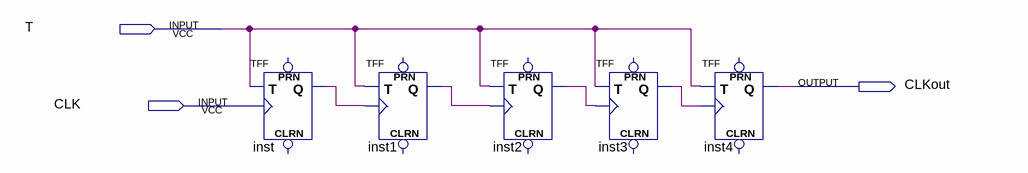
[diagram p0: schematic sheet]
// Quartus schematic ClockDivider32.bdf as structural Verilog: 5 symbols, 3 pins
module ClockDivider32 (
  input  T,
  input  CLK,
  output CLKout
);

  wire inst1_q, inst2_q, inst3_q, inst_q;

  TFF inst (.T(T), .CLK(CLK), .Q(inst_q));  // open: PRN, CLRN
  TFF inst1 (.T(T), .CLK(inst_q), .Q(inst1_q));  // open: PRN, CLRN
  TFF inst2 (.T(T), .CLK(inst1_q), .Q(inst2_q));  // open: PRN, CLRN
  TFF inst3 (.T(T), .CLK(inst2_q), .Q(inst3_q));  // open: PRN, CLRN
  TFF inst4 (.T(T), .CLK(inst3_q), .Q(CLKout));  // open: PRN, CLRN
endmodule
